# Altium schematic sheet zynq soc.SchDoc
size A4
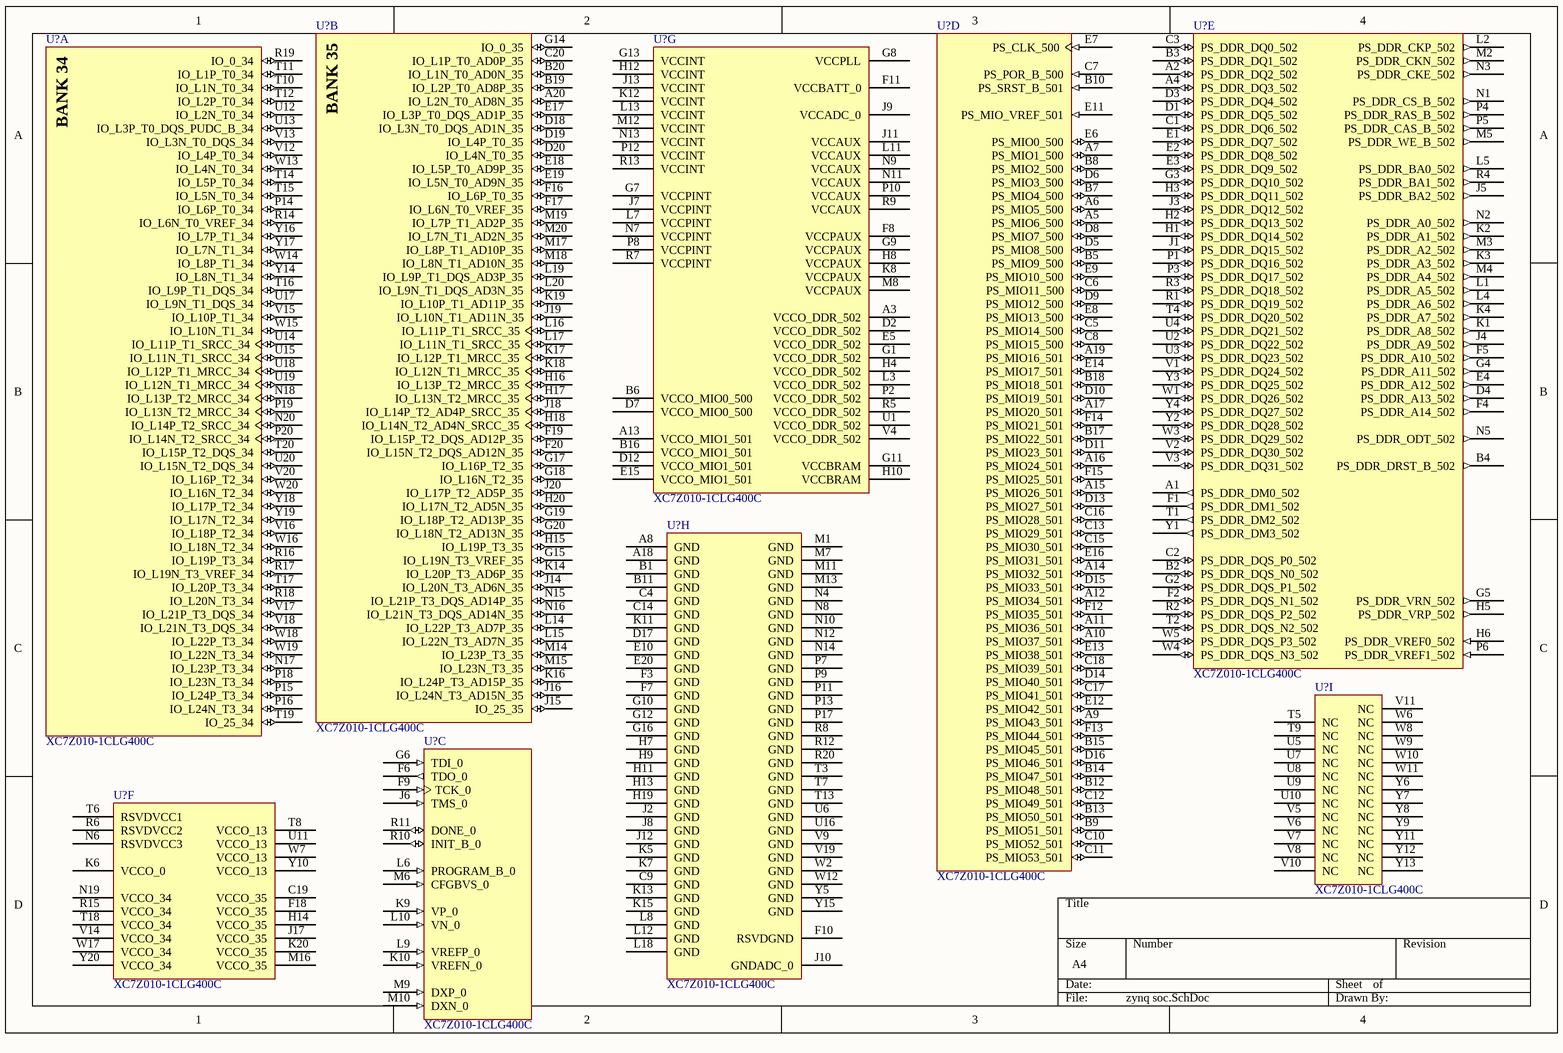
[diagram p0: zynq soc.SchDoc]

## Parts
(Parts that share a designator on the sheet are numbered #1, #2 ... from top to bottom, then left to right.)
U?#1  XC7Z010-1CLG400C  [CLG400]  (part B of 9)
U?#2  XC7Z010-1CLG400C  [CLG400]  (part D of 9)
U?#3  XC7Z010-1CLG400C  [CLG400]  (part E of 9)
U?#4  XC7Z010-1CLG400C  [CLG400]  (part A of 9)
U?#5  XC7Z010-1CLG400C  [CLG400]  (part G of 9)
U?#6  XC7Z010-1CLG400C  [CLG400]  (part H of 9)
U?#7  XC7Z010-1CLG400C  [CLG400]  (part I of 9)
U?#8  XC7Z010-1CLG400C  [CLG400]  (part C of 9)
U?#9  XC7Z010-1CLG400C  [CLG400]  (part F of 9)

## Nets

Not connected (* = marked no-connect by the designer): U?#1 A20(IO_L2N_T0_AD8N_35) B19(IO_L2P_T0_AD8P_35) B20(IO_L1N_T0_AD0N_35) C20(IO_L1P_T0_AD0P_35) D18(IO_L3N_T0_DQS_AD1N_35) D19(IO_L4P_T0_35) D20(IO_L4N_T0_35) E17(IO_L3P_T0_DQS_AD1P_35) E18(IO_L5P_T0_AD9P_35) E19(IO_L5N_T0_AD9N_35) F16(IO_L6P_T0_35) F17(IO_L6N_T0_VREF_35) F19(IO_L15P_T2_DQS_AD12P_35) F20(IO_L15N_T2_DQS_AD12N_35) G14(IO_0_35) G15(IO_L19N_T3_VREF_35) G17(IO_L16P_T2_35) G18(IO_L16N_T2_35) G19(IO_L18P_T2_AD13P_35) G20(IO_L18N_T2_AD13N_35) H15(IO_L19P_T3_35) H16(IO_L13P_T2_MRCC_35) H17(IO_L13N_T2_MRCC_35) H18(IO_L14N_T2_AD4N_SRCC_35) H20(IO_L17N_T2_AD5N_35) J14(IO_L20N_T3_AD6N_35) J15(IO_25_35) J16(IO_L24N_T3_AD15N_35) J18(IO_L14P_T2_AD4P_SRCC_35) J19(IO_L10N_T1_AD11N_35) J20(IO_L17P_T2_AD5P_35) K14(IO_L20P_T3_AD6P_35) K16(IO_L24P_T3_AD15P_35) K17(IO_L12P_T1_MRCC_35) K18(IO_L12N_T1_MRCC_35) K19(IO_L10P_T1_AD11P_35) L14(IO_L22P_T3_AD7P_35) L15(IO_L22N_T3_AD7N_35) L16(IO_L11P_T1_SRCC_35) L17(IO_L11N_T1_SRCC_35) L19(IO_L9P_T1_DQS_AD3P_35) L20(IO_L9N_T1_DQS_AD3N_35) M14(IO_L23P_T3_35) M15(IO_L23N_T3_35) M17(IO_L8P_T1_AD10P_35) M18(IO_L8N_T1_AD10N_35) M19(IO_L7P_T1_AD2P_35) M20(IO_L7N_T1_AD2N_35) N15(IO_L21P_T3_DQS_AD14P_35) N16(IO_L21N_T3_DQS_AD14N_35); U?#2 A5(PS_MIO6_500) A6(PS_MIO5_500) A7(PS_MIO1_500) A9(PS_MIO43_501) A10(PS_MIO37_501) A11(PS_MIO36_501) A12(PS_MIO34_501) A14(PS_MIO32_501) A15(PS_MIO26_501) A16(PS_MIO24_501) A17(PS_MIO20_501) A19(PS_MIO16_501) B5(PS_MIO9_500) B7(PS_MIO4_500) B8(PS_MIO2_500) B9(PS_MIO51_501) B10(PS_SRST_B_501) B12(PS_MIO48_501) B13(PS_MIO50_501) B14(PS_MIO47_501) B15(PS_MIO45_501) B17(PS_MIO22_501) B18(PS_MIO18_501) C5(PS_MIO14_500) C6(PS_MIO11_500) C7(PS_POR_B_500) C8(PS_MIO15_500) C10(PS_MIO52_501) C11(PS_MIO53_501) C12(PS_MIO49_501) C13(PS_MIO29_501) C15(PS_MIO30_501) C16(PS_MIO28_501) C17(PS_MIO41_501) C18(PS_MIO39_501) D5(PS_MIO8_500) D6(PS_MIO3_500) D8(PS_MIO7_500) D9(PS_MIO12_500) D10(PS_MIO19_501) D11(PS_MIO23_501) D13(PS_MIO27_501) D14(PS_MIO40_501) D15(PS_MIO33_501) D16(PS_MIO46_501) E6(PS_MIO0_500) E7(PS_CLK_500) E8(PS_MIO13_500) E9(PS_MIO10_500) E11(PS_MIO_VREF_501) E12(PS_MIO42_501) E13(PS_MIO38_501) E14(PS_MIO17_501) E16(PS_MIO31_501) F12(PS_MIO35_501) F13(PS_MIO44_501) F14(PS_MIO21_501) F15(PS_MIO25_501); U?#3 A1(PS_DDR_DM0_502) A2(PS_DDR_DQ2_502) A4(PS_DDR_DQ3_502) B2(PS_DDR_DQS_N0_502) B3(PS_DDR_DQ1_502) B4(PS_DDR_DRST_B_502) C1(PS_DDR_DQ6_502) C2(PS_DDR_DQS_P0_502) C3(PS_DDR_DQ0_502) D1(PS_DDR_DQ5_502) D3(PS_DDR_DQ4_502) D4(PS_DDR_A13_502) E1(PS_DDR_DQ7_502) E2(PS_DDR_DQ8_502) E3(PS_DDR_DQ9_502) E4(PS_DDR_A12_502) F1(PS_DDR_DM1_502) F2(PS_DDR_DQS_N1_502) F4(PS_DDR_A14_502) F5(PS_DDR_A10_502) G2(PS_DDR_DQS_P1_502) G3(PS_DDR_DQ10_502) G4(PS_DDR_A11_502) G5(PS_DDR_VRN_502) H1(PS_DDR_DQ14_502) H2(PS_DDR_DQ13_502) H3(PS_DDR_DQ11_502) H5(PS_DDR_VRP_502) H6(PS_DDR_VREF0_502) J1(PS_DDR_DQ15_502) J3(PS_DDR_DQ12_502) J4(PS_DDR_A9_502) J5(PS_DDR_BA2_502) K1(PS_DDR_A8_502) K2(PS_DDR_A1_502) K3(PS_DDR_A3_502) K4(PS_DDR_A7_502) L1(PS_DDR_A5_502) L2(PS_DDR_CKP_502) L4(PS_DDR_A6_502) L5(PS_DDR_BA0_502) M2(PS_DDR_CKN_502) M3(PS_DDR_A2_502) M4(PS_DDR_A4_502) M5(PS_DDR_WE_B_502) N1(PS_DDR_CS_B_502) N2(PS_DDR_A0_502) N3(PS_DDR_CKE_502) N5(PS_DDR_ODT_502) P1(PS_DDR_DQ16_502) P3(PS_DDR_DQ17_502) P4(PS_DDR_RAS_B_502) P5(PS_DDR_CAS_B_502) P6(PS_DDR_VREF1_502) R1(PS_DDR_DQ19_502) R2(PS_DDR_DQS_P2_502) R3(PS_DDR_DQ18_502) R4(PS_DDR_BA1_502) T1(PS_DDR_DM2_502) T2(PS_DDR_DQS_N2_502) T4(PS_DDR_DQ20_502) U2(PS_DDR_DQ22_502) U3(PS_DDR_DQ23_502) U4(PS_DDR_DQ21_502) V1(PS_DDR_DQ24_502) V2(PS_DDR_DQ30_502) V3(PS_DDR_DQ31_502) W1(PS_DDR_DQ26_502) W3(PS_DDR_DQ29_502) W4(PS_DDR_DQS_N3_502) W5(PS_DDR_DQS_P3_502) Y1(PS_DDR_DM3_502) Y2(PS_DDR_DQ28_502) Y3(PS_DDR_DQ25_502) Y4(PS_DDR_DQ27_502); U?#4 N17(IO_L23P_T3_34) N18(IO_L13P_T2_MRCC_34) N20(IO_L14P_T2_SRCC_34) P14(IO_L6P_T0_34) P15(IO_L24P_T3_34) P16(IO_L24N_T3_34) P18(IO_L23N_T3_34) P19(IO_L13N_T2_MRCC_34) P20(IO_L14N_T2_SRCC_34) R14(IO_L6N_T0_VREF_34) R16(IO_L19P_T3_34) R17(IO_L19N_T3_VREF_34) R18(IO_L20N_T3_34) R19(IO_0_34) T10(IO_L1N_T0_34) T11(IO_L1P_T0_34) T12(IO_L2P_T0_34) T14(IO_L5P_T0_34) T15(IO_L5N_T0_34) T16(IO_L9P_T1_DQS_34) T17(IO_L20P_T3_34) T19(IO_25_34) T20(IO_L15P_T2_DQS_34) U12(IO_L2N_T0_34) U13(IO_L3P_T0_DQS_PUDC_B_34) U14(IO_L11P_T1_SRCC_34) U15(IO_L11N_T1_SRCC_34) U17(IO_L9N_T1_DQS_34) U18(IO_L12P_T1_MRCC_34) U19(IO_L12N_T1_MRCC_34) U20(IO_L15N_T2_DQS_34) V12(IO_L4P_T0_34) V13(IO_L3N_T0_DQS_34) V15(IO_L10P_T1_34) V16(IO_L18P_T2_34) V17(IO_L21P_T3_DQS_34) V18(IO_L21N_T3_DQS_34) V20(IO_L16P_T2_34) W13(IO_L4N_T0_34) W14(IO_L8P_T1_34) W15(IO_L10N_T1_34) W16(IO_L18N_T2_34) W18(IO_L22P_T3_34) W19(IO_L22N_T3_34) W20(IO_L16N_T2_34) Y14(IO_L8N_T1_34) Y16(IO_L7P_T1_34) Y17(IO_L7N_T1_34) Y18(IO_L17P_T2_34) Y19(IO_L17N_T2_34); U?#5 A3(VCCO_DDR_502) A13(VCCO_MIO1_501) B6(VCCO_MIO0_500) B16(VCCO_MIO1_501) D2(VCCO_DDR_502) D7(VCCO_MIO0_500) D12(VCCO_MIO1_501) E5(VCCO_DDR_502) E15(VCCO_MIO1_501) F8(VCCPAUX) F11(VCCBATT_0) G1(VCCO_DDR_502) G7(VCCPINT) G8(VCCPLL) G9(VCCPAUX) G11(VCCBRAM) G13(VCCINT) H4(VCCO_DDR_502) H8(VCCPAUX) H10(VCCBRAM) H12(VCCINT) J7(VCCPINT) J9(VCCADC_0) J11(VCCAUX) J13(VCCINT) K8(VCCPAUX) K12(VCCINT) L3(VCCO_DDR_502) L7(VCCPINT) L11(VCCAUX) L13(VCCINT) M8(VCCPAUX) M12(VCCINT) N7(VCCPINT) N9(VCCAUX) N11(VCCAUX) N13(VCCINT) P2(VCCO_DDR_502) P8(VCCPINT) P10(VCCAUX) P12(VCCINT) R5(VCCO_DDR_502) R7(VCCPINT) R9(VCCAUX) R13(VCCINT) U1(VCCO_DDR_502) V4(VCCO_DDR_502); U?#6 A8(GND) A18(GND) B1(GND) B11(GND) C4(GND) C9(GND) C14(GND) D17(GND) E10(GND) E20(GND) F3(GND) F7(GND) F10(RSVDGND) G10(GND) G12(GND) G16(GND) H7(GND) H9(GND) H11(GND) H13(GND) H19(GND) J2(GND) J8(GND) J10(GNDADC_0) J12(GND) K5(GND) K7(GND) K11(GND) K13(GND) K15(GND) L8(GND) L12(GND) L18(GND) M1(GND) M7(GND) M11(GND) M13(GND) N4(GND) N8(GND) N10(GND) N12(GND) N14(GND) P7(GND) P9(GND) P11(GND) P13(GND) P17(GND) R8(GND) R12(GND) R20(GND) T3(GND) T7(GND) T13(GND) U6(GND) U16(GND) V9(GND) V19(GND) W2(GND) W12(GND) Y5(GND) Y15(GND); U?#7 T5(NC) T9(NC) U5(NC) U7(NC) U8(NC) U9(NC) U10(NC) V5(NC) V6(NC) V7(NC) V8(NC) V10(NC) V11(NC) W6(NC) W8(NC) W9(NC) W10(NC) W11(NC) Y6(NC) Y7(NC) Y8(NC) Y9(NC) Y11(NC) Y12(NC) Y13(NC); U?#8 F6(TDO_0) F9(TCK_0) G6(TDI_0) J6(TMS_0) K9(VP_0) K10(VREFN_0) L6(PROGRAM_B_0) L9(VREFP_0) L10(VN_0) M6(CFGBVS_0) M9(DXP_0) M10(DXN_0) R10(INIT_B_0) R11(DONE_0); U?#9 C19(VCCO_35) F18(VCCO_35) H14(VCCO_35) J17(VCCO_35) K6(VCCO_0) K20(VCCO_35) M16(VCCO_35) N6(RSVDVCC3) N19(VCCO_34) R6(RSVDVCC2) R15(VCCO_34) T6(RSVDVCC1) T8(VCCO_13) T18(VCCO_34) U11(VCCO_13) V14(VCCO_34) W7(VCCO_13) W17(VCCO_34) Y10(VCCO_13) Y20(VCCO_34)

## Notes on the sheet
- (in symbol CMP-0363-00007-3, part A) BANK 34
- (in symbol CMP-0363-00007-3, part B) BANK 35

## Library data of the parts
U?#1-U?#9 = CMP-0363-00007-3: 667 MHz Zynq™-7000 AP SoC, 130 PS I/O, 100 FPGA I/O, 400-Ball BGA, Speed Grade 1, Commercial Grade, Pb-Free; Flip Flops: 35200; Speed Grade: -1; LUTs: 17600; Extensible Block RAM (# 36Kb Blocks): 240 KB (60); ComponentLink6Description: PCB and Layout Guide; ComponentLink3Description: DC and AC Switching Characteristics; ComponentLink2URL: http://www.xilinx.com/support/documentation/user_guides/ug865-Zynq-7000-Pkg-Pinout.pdf; PackageReference: CLG400; ComponentLink3URL: http://www.xilinx.com/support/documentation/data_sheets/ds187-XC7Z010-XC7Z020-Data-Sheet.pdf; DatasheetVersion: v1.2; Generic Part Number: XC7Z010; ComponentLink2Description: Package Specification; ComponentLink1Description: Datasheet; PartNumber: XC7Z010-1CLG400C; ComponentLink5Description: Packaging and Pinout; Code_JEDEC: MO-275-MMAA-1; RoHS: Pb-Free; ComponentLink5URL: http://www.xilinx.com/support/documentation/user_guides/ug865-Zynq-7000-Pkg-Pinout.pdf; ComponentLink1URL: http://www.xilinx.com/support/documentation/data_sheets/ds190-Zynq-7000-Overview.pdf; ComponentLink4Description: Package File; ComponentLink4URL: http://www.xilinx.com/support/packagefiles/z7packages/xc7z010clg400pkg.txt; PackageDescription: Wire-Bond Chip-Scale BGA, Body 17 x 17 mm, 0.8 mm Pitch; PackageVersion: Rev 1.1, 09/2012; Mounting Technology: Surface Mount; ComponentLink6URL: http://www.xilinx.com/support/documentation/user_guides/ug483_7Series_PCB.pdf